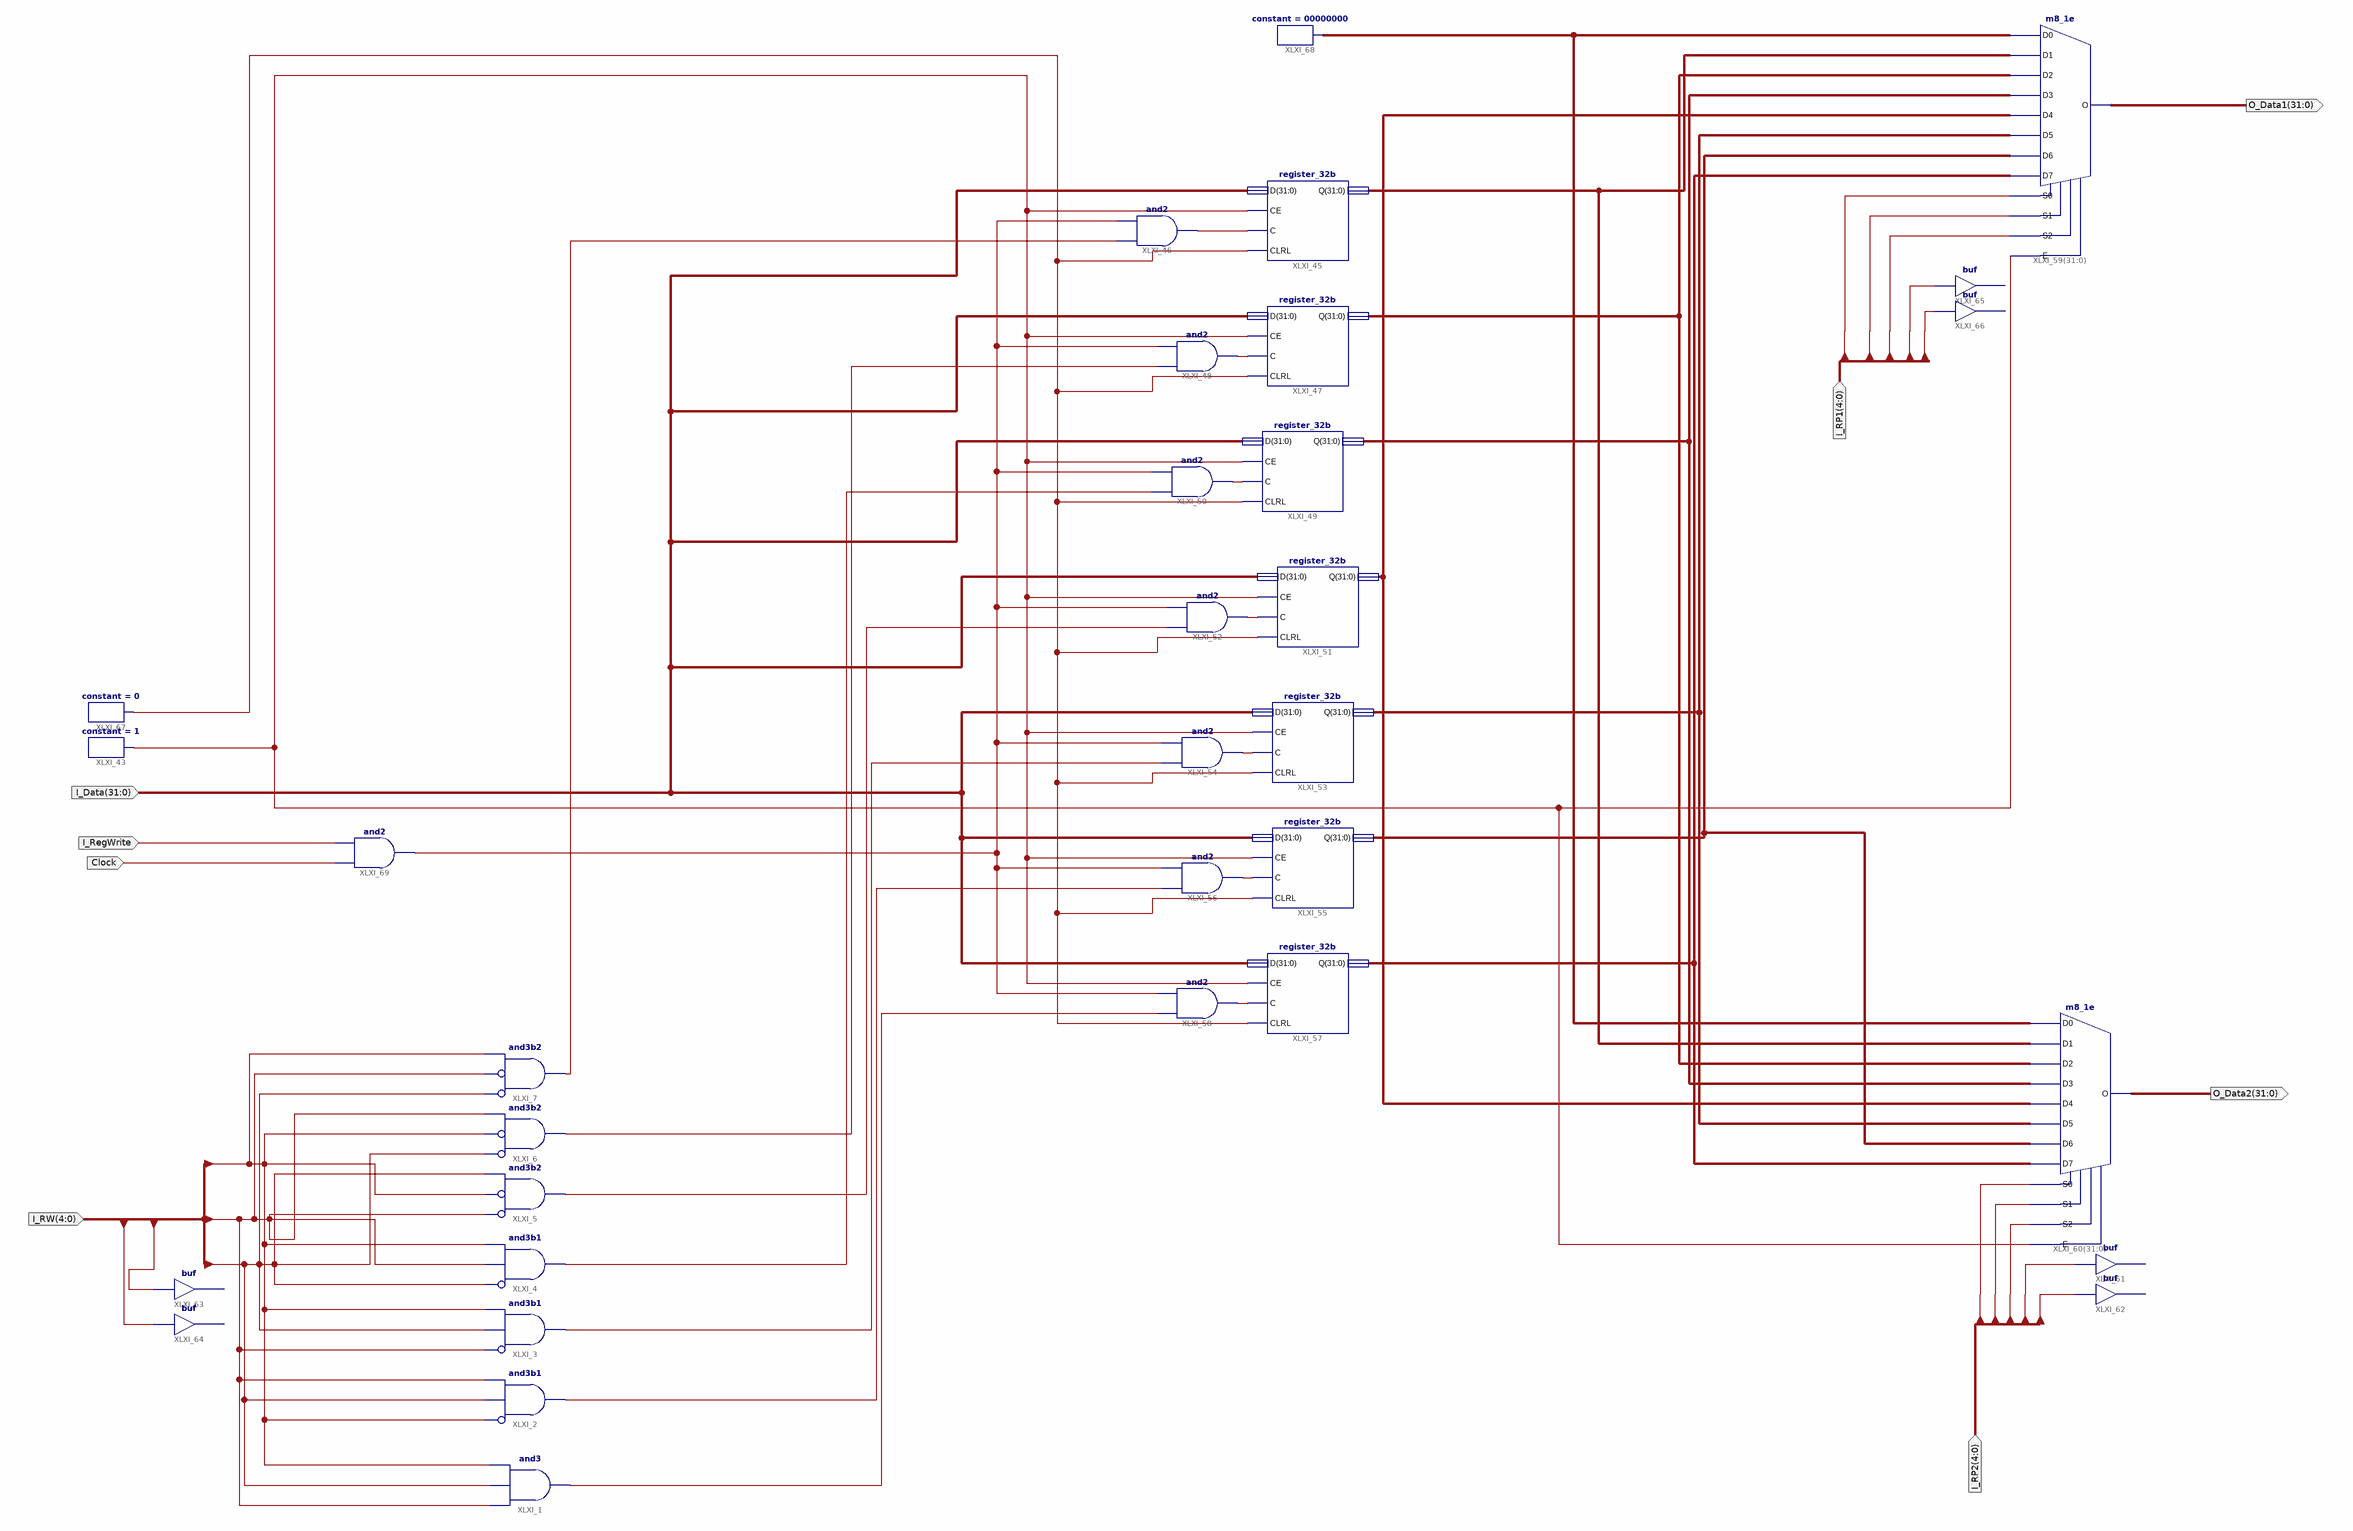
[diagram p0: schematic sheet 1]
// Xilinx ISE schematic register_file.sch (spartan3) as structural Verilog: 33 symbols, 8 ports
module register_file (
  input  [4:0] I_RP2,
  input  [4:0] I_RP1,
  input  [4:0] I_RW,
  input  [31:0] I_Data,
  input  Clock,
  input  I_RegWrite,
  output [31:0] O_Data1,
  output [31:0] O_Data2
);

  wire XLXN_6, XLXN_7, XLXN_41, XLXN_46, XLXN_47, XLXN_48, XLXN_49, XLXN_76, XLXN_77, XLXN_78, XLXN_79,
       XLXN_80, XLXN_81, XLXN_82, XLXN_90, XLXN_112, XLXN_115;
  wire [31:0] R0, R1, R2, R3, R4, R5, R6, R7;

  and XLXI_1 (XLXN_82, I_RW[1], I_RW[2], I_RW[0]);
  and XLXI_2 (XLXN_81, ~I_RW[0], I_RW[2], I_RW[1]);  // and3b1
  and XLXI_3 (XLXN_80, ~I_RW[1], I_RW[2], I_RW[0]);  // and3b1
  and XLXI_4 (XLXN_78, ~I_RW[2], I_RW[1], I_RW[0]);  // and3b1
  and XLXI_5 (XLXN_79, ~I_RW[1], ~I_RW[0], I_RW[2]);  // and3b2
  and XLXI_6 (XLXN_77, ~I_RW[2], ~I_RW[0], I_RW[1]);  // and3b2
  and XLXI_7 (XLXN_76, ~I_RW[2], ~I_RW[1], I_RW[0]);  // and3b2
  register_32b XLXI_45 (.D(I_Data), .CE(XLXN_90), .C(XLXN_115), .CLRL(XLXN_41), .Q(R1));
  and XLXI_46 (XLXN_115, XLXN_76, XLXN_112);
  register_32b XLXI_47 (.D(I_Data), .CE(XLXN_90), .C(XLXN_46), .CLRL(XLXN_41), .Q(R2));
  register_32b XLXI_49 (.D(I_Data), .CE(XLXN_90), .C(XLXN_47), .CLRL(XLXN_41), .Q(R3));
  and XLXI_50 (XLXN_47, XLXN_78, XLXN_112);
  register_32b XLXI_51 (.D(I_Data), .CE(XLXN_90), .C(XLXN_48), .CLRL(XLXN_41), .Q(R4));
  and XLXI_52 (XLXN_48, XLXN_79, XLXN_112);
  register_32b XLXI_53 (.D(I_Data), .CE(XLXN_90), .C(XLXN_49), .CLRL(XLXN_41), .Q(R5));
  and XLXI_54 (XLXN_49, XLXN_80, XLXN_112);
  register_32b XLXI_55 (.D(I_Data), .CE(XLXN_90), .C(XLXN_6), .CLRL(XLXN_41), .Q(R6));
  and XLXI_56 (XLXN_6, XLXN_81, XLXN_112);
  register_32b XLXI_57 (.D(I_Data), .CE(XLXN_90), .C(XLXN_7), .CLRL(XLXN_41), .Q(R7));
  and XLXI_58 (XLXN_7, XLXN_82, XLXN_112);
  m8_1e XLXI_59[31:0] (
    .D0(R0), .D1(R1), .D2(R2), .D3(R3), .D4(R4), .D5(R5), .D6(R6), .D7(R7), .E(XLXN_90), .S0(I_RP1[0]),
    .S1(I_RP1[1]), .S2(I_RP1[2]), .O(O_Data1));
  m8_1e XLXI_60[31:0] (
    .D0(R0), .D1(R1), .D2(R2), .D3(R3), .D4(R4), .D5(R5), .D6(R6), .D7(R7), .E(XLXN_90), .S0(I_RP2[0]),
    .S1(I_RP2[1]), .S2(I_RP2[2]), .O(O_Data2));
  // buf XLXI_62 has open pins: I=I_RP2[4], O=open
  // buf XLXI_61 has open pins: I=I_RP2[3], O=open
  // buf XLXI_63 has open pins: I=I_RW[3], O=open
  // buf XLXI_64 has open pins: I=I_RW[4], O=open
  // buf XLXI_65 has open pins: I=I_RP1[3], O=open
  // buf XLXI_66 has open pins: I=I_RP1[4], O=open
  constant #(.CValue("0")) XLXI_67 (.O(XLXN_41));
  constant #(.CValue("00000000")) XLXI_68 (.O(R0));
  constant #(.CValue("1")) XLXI_43 (.O(XLXN_90));
  and XLXI_69 (XLXN_112, Clock, I_RegWrite);
  and XLXI_48 (XLXN_46, XLXN_77, XLXN_112);
endmodule
